# EAGLE schematic ahcp (EAGLE 7.4.0)
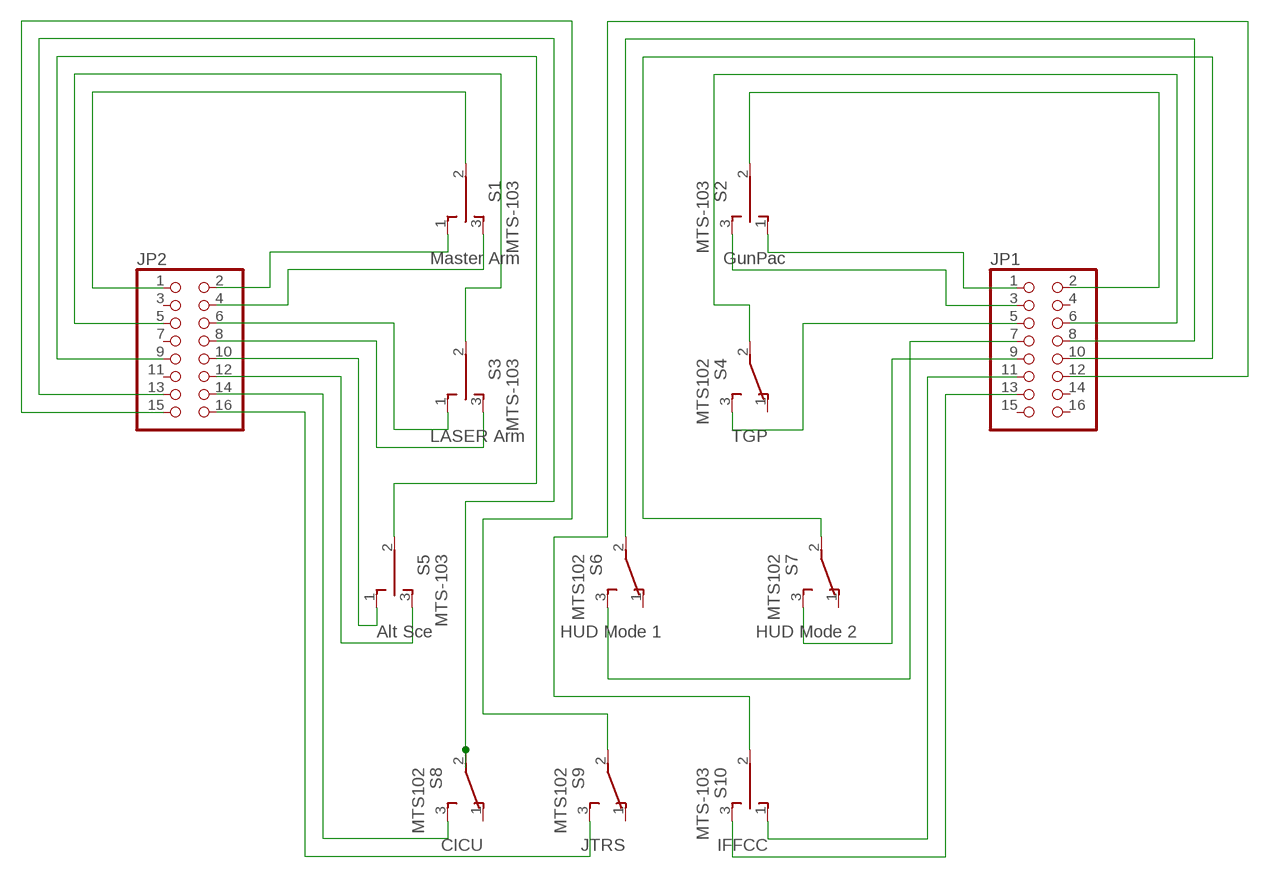
[diagram p0: schematic, sheet 1]

## Parts
JP1  PINHD-2X8  [2X08]
JP2  PINHD-2X8  [2X08]
S1  MTS-103  TL39PO  [TL3XPO]
S2  MTS-103  TL39PO  [TL3XPO]
S3  MTS-103  TL39PO  [TL3XPO]
S4  MTS102  TL36PO  [TL3XPO]
S5  MTS-103  TL39PO  [TL3XPO]
S6  MTS102  TL36PO  [TL3XPO]
S7  MTS102  TL36PO  [TL3XPO]
S8  MTS102  TL36PO  [TL3XPO]
S9  MTS102  TL36PO  [TL3XPO]
S10  MTS-103  TL39PO  [TL3XPO]

## Nets
N$1: JP2.1 S1.2(P)
N$2: JP2.2 S1.1(O)
N$3: JP2.4 S1.3(S)
N$4: JP2.5 S3.2(P)
N$5: JP2.6 S3.1(O)
N$6: JP2.8 S3.3(S)
N$7: JP2.9 S5.2(P)
N$8: JP2.13 S8.2(P)
N$9: JP2.15 S9.2(P)
N$10: JP2.10 S5.1(O)
N$11: JP2.12 S5.3(S)
N$12: JP2.14 S8.3(S)
N$13: JP2.16 S9.3(S)
N$14: JP1.2 S2.2(P)
N$15: JP1.6 S4.2(P)
N$16: JP1.8 S6.2(P)
N$17: JP1.10 S7.2(P)
N$18: JP1.12 S10.2(P)
N$19: JP1.1 S2.1(O)
N$20: JP1.3 S2.3(S)
N$21: JP1.5 S4.3(S)
N$22: JP1.7 S6.3(S)
N$23: JP1.11 S10.1(O)
N$24: JP1.9 S7.3(S)
N$25: JP1.13 S10.3(S)
Unconnected: JP1.4 JP1.14 JP1.15 JP1.16 JP2.3 JP2.7 JP2.11 S4.1(O) S6.1(O) S7.1(O) S8.1(O) S9.1(O)

## Library data of the parts
JP1 JP2 = pinhead:PINHD-2X8: PIN HEADER
S1 = switch:TL39PO: TINY SWITCH ON OFF ON Source: http://www2.produktinfo.conrad.com/datenblaetter/700000-724999/705152-da-01-de-Subminiaturschalter_TL_36YO.pdf; A10: Master Arm
S2 = switch:TL39PO: TINY SWITCH ON OFF ON Source: http://www2.produktinfo.conrad.com/datenblaetter/700000-724999/705152-da-01-de-Subminiaturschalter_TL_36YO.pdf; A10: GunPac
S3 = switch:TL39PO: TINY SWITCH ON OFF ON Source: http://www2.produktinfo.conrad.com/datenblaetter/700000-724999/705152-da-01-de-Subminiaturschalter_TL_36YO.pdf; A10: LASER Arm
S4 = switch:TL36PO: TINY SWITCH ON - ON Source: http://www2.produktinfo.conrad.com/datenblaetter/700000-724999/705152-da-01-de-Subminiaturschalter_TL_36YO.pdf; A10: TGP
S5 = switch:TL39PO: TINY SWITCH ON OFF ON Source: http://www2.produktinfo.conrad.com/datenblaetter/700000-724999/705152-da-01-de-Subminiaturschalter_TL_36YO.pdf; A10: Alt Sce
S6 = switch:TL36PO: TINY SWITCH ON - ON Source: http://www2.produktinfo.conrad.com/datenblaetter/700000-724999/705152-da-01-de-Subminiaturschalter_TL_36YO.pdf; A10: HUD Mode 1
S7 = switch:TL36PO: TINY SWITCH ON - ON Source: http://www2.produktinfo.conrad.com/datenblaetter/700000-724999/705152-da-01-de-Subminiaturschalter_TL_36YO.pdf; A10: HUD Mode 2
S8 = switch:TL36PO: TINY SWITCH ON - ON Source: http://www2.produktinfo.conrad.com/datenblaetter/700000-724999/705152-da-01-de-Subminiaturschalter_TL_36YO.pdf; A10: CICU
S9 = switch:TL36PO: TINY SWITCH ON - ON Source: http://www2.produktinfo.conrad.com/datenblaetter/700000-724999/705152-da-01-de-Subminiaturschalter_TL_36YO.pdf; A10: JTRS
S10 = switch:TL39PO: TINY SWITCH ON OFF ON Source: http://www2.produktinfo.conrad.com/datenblaetter/700000-724999/705152-da-01-de-Subminiaturschalter_TL_36YO.pdf; A10: IFFCC